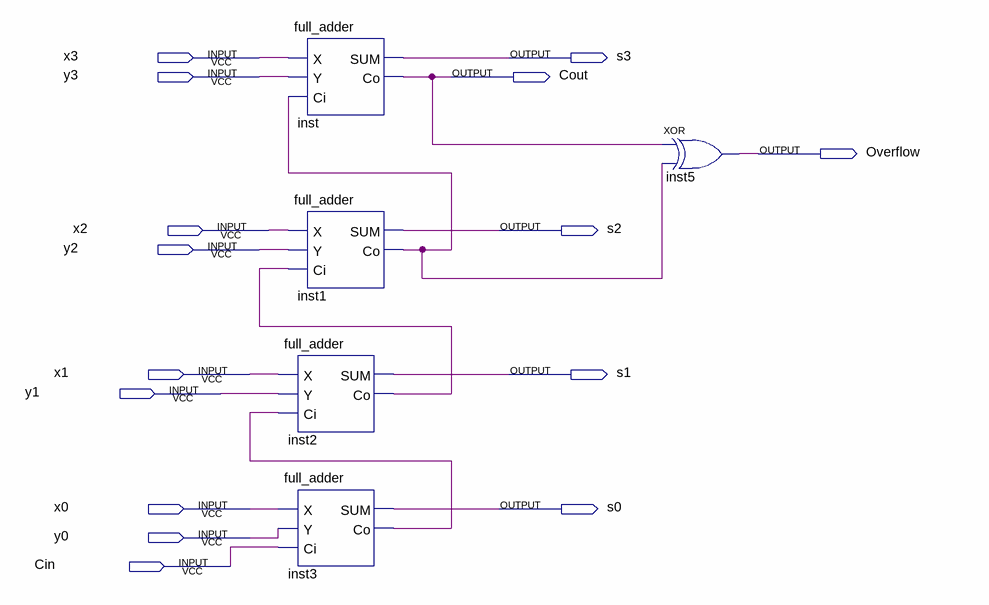
[diagram p0: schematic sheet]
// Quartus schematic adder_4bit.bdf as structural Verilog: 5 symbols, 15 pins
module adder_4bit (
  input  x3,
  input  y3,
  input  x2,
  input  y2,
  input  x1,
  input  y1,
  input  x0,
  input  y0,
  input  Cin,
  output s3,
  output Cout,
  output Overflow,
  output s2,
  output s1,
  output s0
);

  wire inst1_co, inst2_co, inst3_co;

  full_adder inst (.X(x3), .Y(y3), .Ci(inst1_co), .SUM(s3), .Co(Cout));
  full_adder inst1 (.X(x2), .Y(y2), .Ci(inst2_co), .SUM(s2), .Co(inst1_co));
  full_adder inst2 (.X(x1), .Y(y1), .Ci(inst3_co), .SUM(s1), .Co(inst2_co));
  full_adder inst3 (.X(x0), .Y(y0), .Ci(Cin), .SUM(s0), .Co(inst3_co));
  xor inst5 (Overflow, Cout, inst1_co);
endmodule
